# Altium schematic sheet RAM1_top.SchDoc
size 381 x 381 mm; SheetNumber: 1; SheetTotal: 2
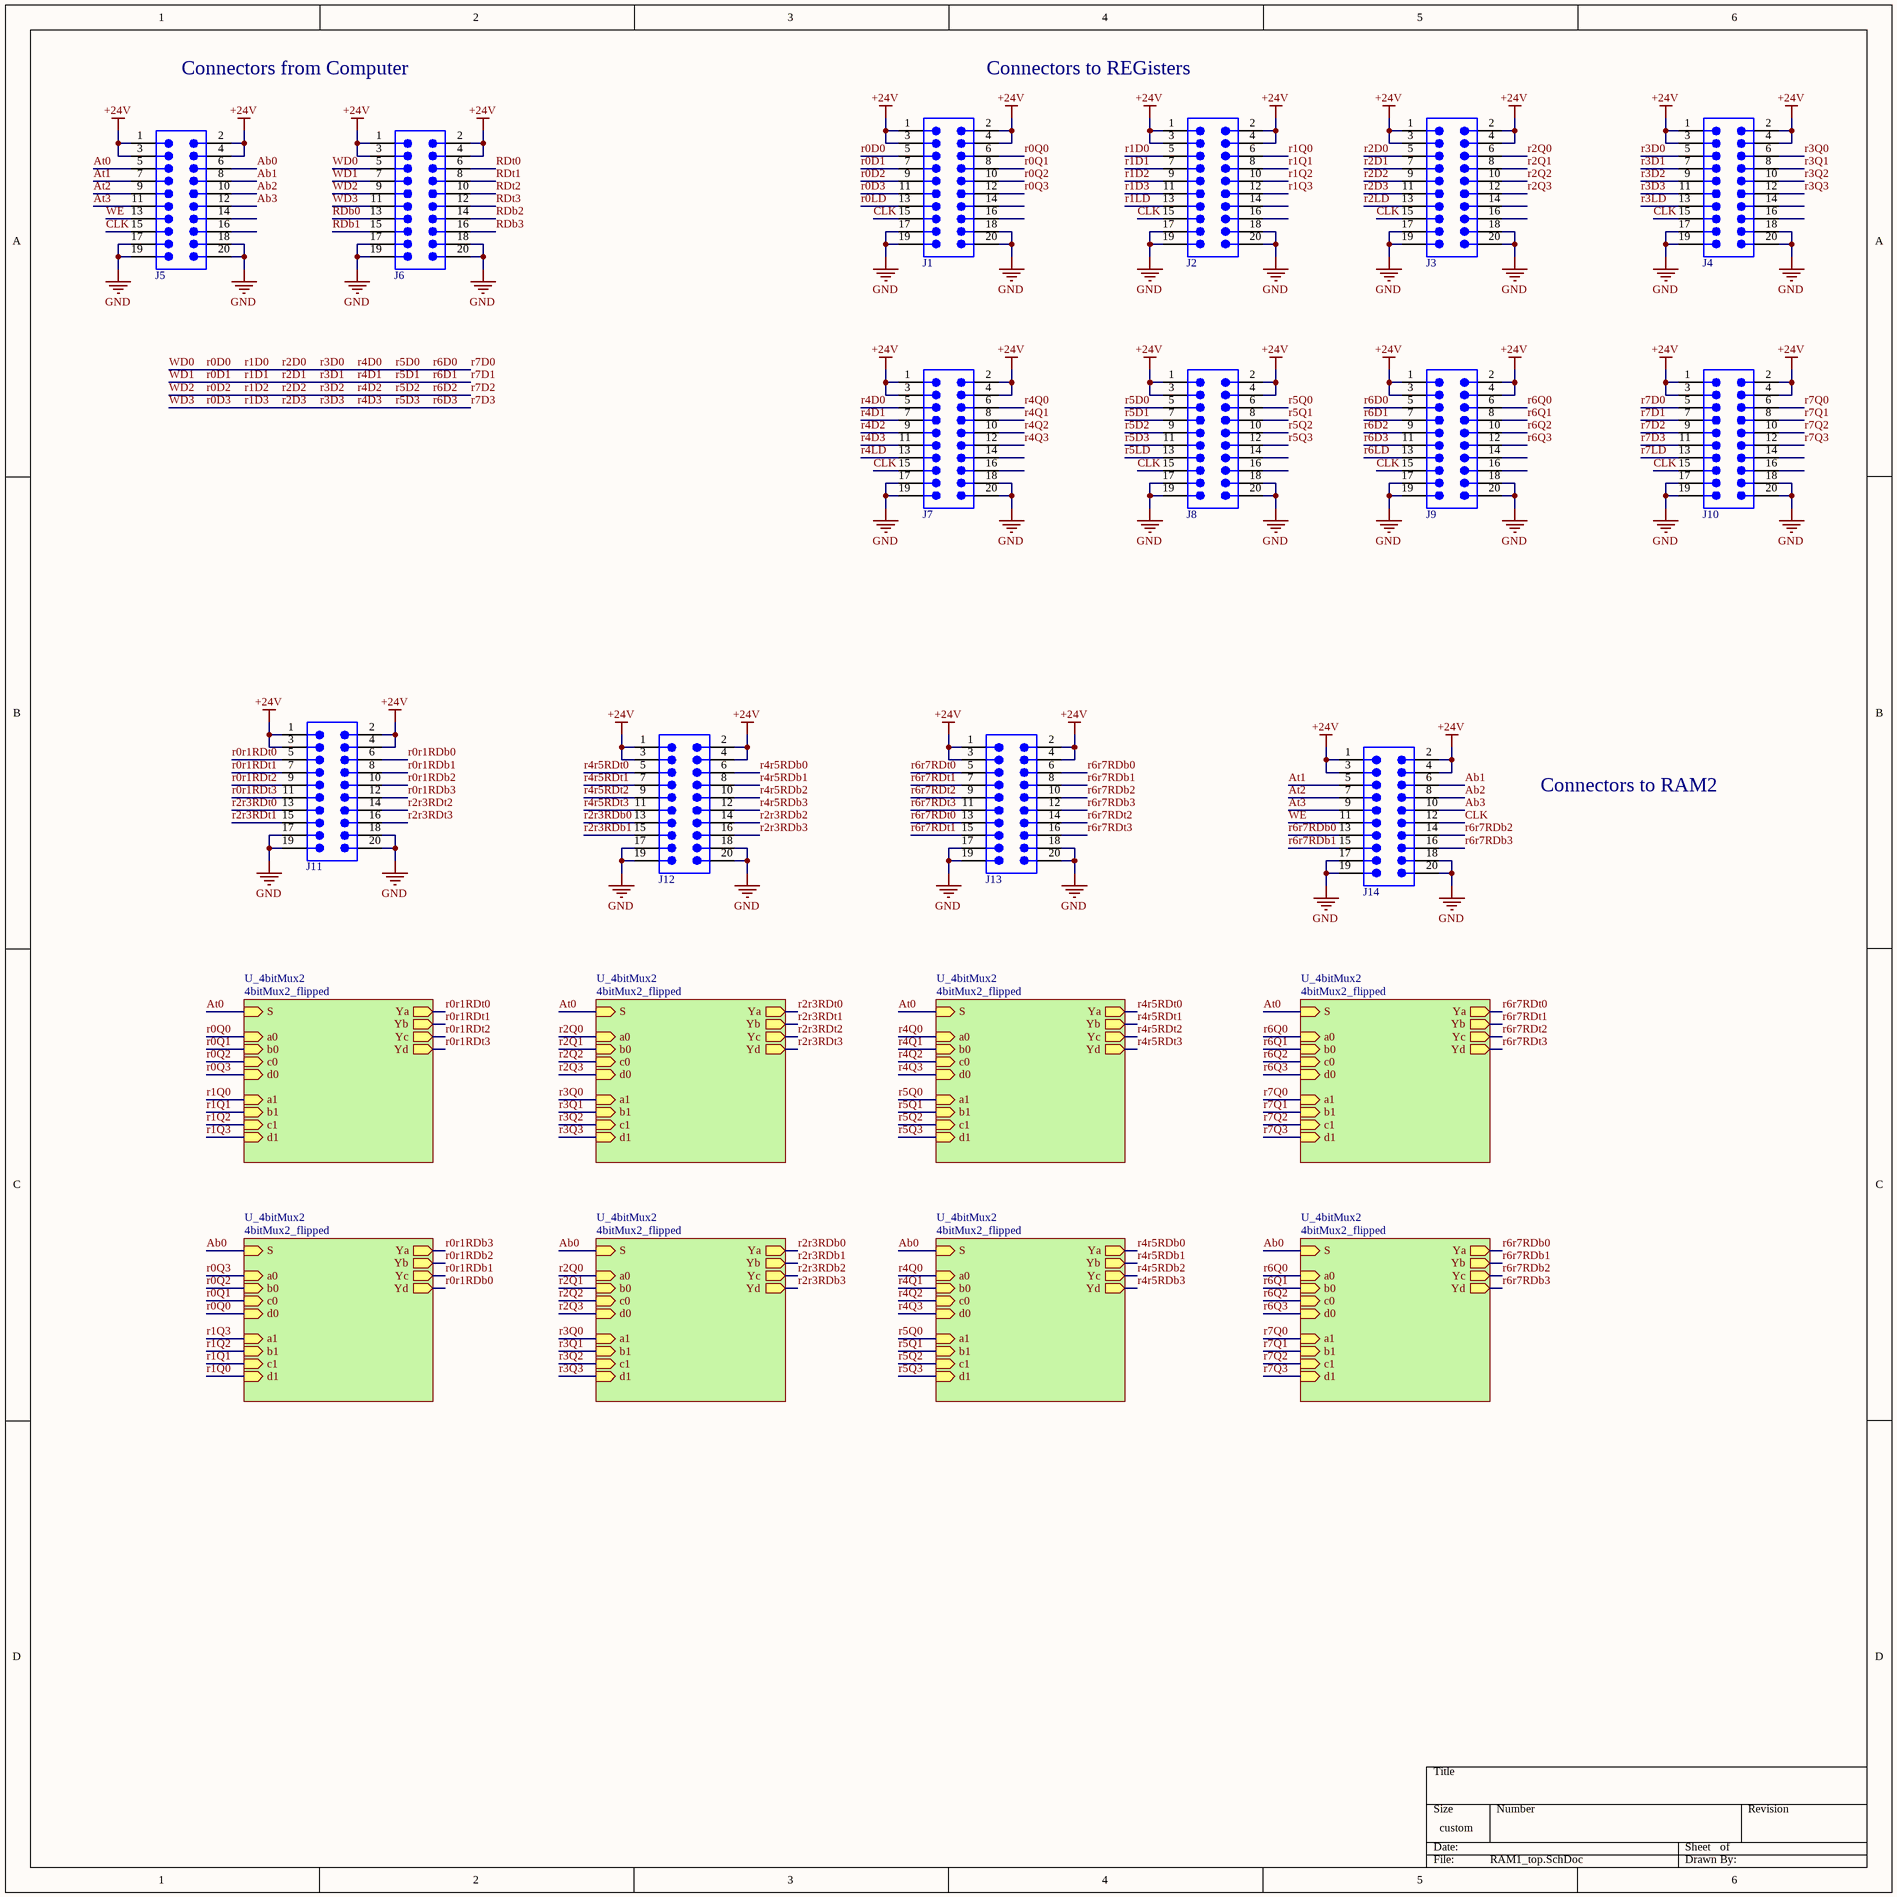
[diagram p0: RAM1_top.SchDoc]

## Parts
J1  Con 2.54mm 10x2pos  [Con 2.54mm 10x2pos]  (value not drawn)
J2  Con 2.54mm 10x2pos  [Con 2.54mm 10x2pos]  (value not drawn)
J3  Con 2.54mm 10x2pos  [Con 2.54mm 10x2pos]  (value not drawn)
J4  Con 2.54mm 10x2pos  [Con 2.54mm 10x2pos]  (value not drawn)
J5  Con 2.54mm 10x2pos  [Con 2.54mm 10x2pos]  (value not drawn)
J6  Con 2.54mm 10x2pos  [Con 2.54mm 10x2pos]  (value not drawn)
J7  Con 2.54mm 10x2pos  [Con 2.54mm 10x2pos]  (value not drawn)
J8  Con 2.54mm 10x2pos  [Con 2.54mm 10x2pos]  (value not drawn)
J9  Con 2.54mm 10x2pos  [Con 2.54mm 10x2pos]  (value not drawn)
J10  Con 2.54mm 10x2pos  [Con 2.54mm 10x2pos]  (value not drawn)
J11  Con 2.54mm 10x2pos  [Con 2.54mm 10x2pos]  (value not drawn)
J12  Con 2.54mm 10x2pos  [Con 2.54mm 10x2pos]  (value not drawn)
J13  Con 2.54mm 10x2pos  [Con 2.54mm 10x2pos]  (value not drawn)
J14  Con 2.54mm 10x2pos  [Con 2.54mm 10x2pos]  (value not drawn)

## Sub-sheets
U_4bitMux2 = 4bitMux2_flipped: S (in), a0 (in), a1 (in), Ya (out), b0 (in), b1 (in), Yb (out), c0 (in), c1 (in), Yc (out), d0 (in), d1 (in), Yd (out)
U_4bitMux2 = 4bitMux2_flipped: S (in), a0 (in), a1 (in), Ya (out), b0 (in), b1 (in), Yb (out), c0 (in), c1 (in), Yc (out), d0 (in), d1 (in), Yd (out)
U_4bitMux2 = 4bitMux2_flipped: S (in), a0 (in), a1 (in), Ya (out), b0 (in), b1 (in), Yb (out), c0 (in), c1 (in), Yc (out), d0 (in), d1 (in), Yd (out)
U_4bitMux2 = 4bitMux2_flipped: S (in), a0 (in), a1 (in), Ya (out), b0 (in), b1 (in), Yb (out), c0 (in), c1 (in), Yc (out), d0 (in), d1 (in), Yd (out)
U_4bitMux2 = 4bitMux2_flipped: S (in), a0 (in), a1 (in), Ya (out), b0 (in), b1 (in), Yb (out), c0 (in), c1 (in), Yc (out), d0 (in), d1 (in), Yd (out)
U_4bitMux2 = 4bitMux2_flipped: S (in), a0 (in), a1 (in), Ya (out), b0 (in), b1 (in), Yb (out), c0 (in), c1 (in), Yc (out), d0 (in), d1 (in), Yd (out)
U_4bitMux2 = 4bitMux2_flipped: S (in), a0 (in), a1 (in), Ya (out), b0 (in), b1 (in), Yb (out), c0 (in), c1 (in), Yc (out), d0 (in), d1 (in), Yd (out)
U_4bitMux2 = 4bitMux2_flipped: S (in), a0 (in), a1 (in), Ya (out), b0 (in), b1 (in), Yb (out), c0 (in), c1 (in), Yc (out), d0 (in), d1 (in), Yd (out)

## Nets
+24V: J1.1 J1.2 J1.3 J1.4 J2.1 J2.2 J2.3 J2.4 J3.1 J3.2 J3.3 J3.4 J4.1 J4.2 J4.3 J4.4 J5.1 J5.2 J5.3 J5.4 J6.1 J6.2 J6.3 J6.4 J7.1 J7.2 J7.3 J7.4 J8.1 J8.2 J8.3 J8.4 J9.1 J9.2 J9.3 J9.4 J10.1 J10.2 J10.3 J10.4 J11.1 J11.2 J11.3 J11.4 J12.1 J12.2 J12.3 J12.4 J13.1 J13.2 J13.3 J13.4 J14.1 J14.2 J14.3 J14.4
GND: J1.17 J1.18 J1.19 J1.20 J2.17 J2.18 J2.19 J2.20 J3.17 J3.18 J3.19 J3.20 J4.17 J4.18 J4.19 J4.20 J5.17 J5.18 J5.19 J5.20 J6.17 J6.18 J6.19 J6.20 J7.17 J7.18 J7.19 J7.20 J8.17 J8.18 J8.19 J8.20 J9.17 J9.18 J9.19 J9.20 J10.17 J10.18 J10.19 J10.20 J11.17 J11.18 J11.19 J11.20 J12.17 J12.18 J12.19 J12.20 J13.17 J13.18 J13.19 J13.20 J14.17 J14.18 J14.19 J14.20
Ab0: J5.6 ; sheet U_4bitMux2/S, sheet U_4bitMux2/S, sheet U_4bitMux2/S, sheet U_4bitMux2/S
Ab1: J5.8 J14.6
Ab2: J5.10 J14.8
Ab3: J5.12 J14.10
At0: J5.5 ; sheet U_4bitMux2/S, sheet U_4bitMux2/S, sheet U_4bitMux2/S, sheet U_4bitMux2/S
At1: J5.7 J14.5
At2: J5.9 J14.7
At3: J5.11 J14.9
CLK: J1.15 J2.15 J3.15 J4.15 J5.15 J7.15 J8.15 J9.15 J10.15 J14.12
r0D0: J1.5 J2.5 J3.5 J4.5 J6.5 J7.5 J8.5 J9.5 J10.5  [also labelled r1D0, r2D0, r3D0, r4D0, r5D0, r6D0, r7D0, WD0]
r0D1: J1.7 J2.7 J3.7 J4.7 J6.7 J7.7 J8.7 J9.7 J10.7  [also labelled r1D1, r2D1, r3D1, r4D1, r5D1, r6D1, r7D1, WD1]
r0D2: J1.9 J2.9 J3.9 J4.9 J6.9 J7.9 J8.9 J9.9 J10.9  [also labelled r1D2, r2D2, r3D2, r4D2, r5D2, r6D2, r7D2, WD2]
r0D3: J1.11 J2.11 J3.11 J4.11 J6.11 J7.11 J8.11 J9.11 J10.11  [also labelled r1D3, r2D3, r3D3, r4D3, r5D3, r6D3, r7D3, WD3]
r0LD: J1.13
r0Q0: J1.6 ; sheet U_4bitMux2/a0, sheet U_4bitMux2/d0
r0Q1: J1.8 ; sheet U_4bitMux2/b0, sheet U_4bitMux2/c0
r0Q2: J1.10 ; sheet U_4bitMux2/c0, sheet U_4bitMux2/b0
r0Q3: J1.12 ; sheet U_4bitMux2/d0, sheet U_4bitMux2/a0
r0r1RDb0: J11.6 ; sheet U_4bitMux2/Yd
r0r1RDb1: J11.8 ; sheet U_4bitMux2/Yc
r0r1RDb2: J11.10 ; sheet U_4bitMux2/Yb
r0r1RDb3: J11.12 ; sheet U_4bitMux2/Ya
r0r1RDt0: J11.5 ; sheet U_4bitMux2/Ya
r0r1RDt1: J11.7 ; sheet U_4bitMux2/Yb
r0r1RDt2: J11.9 ; sheet U_4bitMux2/Yc
r0r1RDt3: J11.11 ; sheet U_4bitMux2/Yd
r1LD: J2.13
r1Q0: J2.6 ; sheet U_4bitMux2/a1, sheet U_4bitMux2/d1
r1Q1: J2.8 ; sheet U_4bitMux2/b1, sheet U_4bitMux2/c1
r1Q2: J2.10 ; sheet U_4bitMux2/c1, sheet U_4bitMux2/b1
r1Q3: J2.12 ; sheet U_4bitMux2/d1, sheet U_4bitMux2/a1
r2LD: J3.13
r2Q0: J3.6 ; sheet U_4bitMux2/a0, sheet U_4bitMux2/a0
r2Q1: J3.8 ; sheet U_4bitMux2/b0, sheet U_4bitMux2/b0
r2Q2: J3.10 ; sheet U_4bitMux2/c0, sheet U_4bitMux2/c0
r2Q3: J3.12 ; sheet U_4bitMux2/d0, sheet U_4bitMux2/d0
r2r3RDb0: J12.13 ; sheet U_4bitMux2/Ya
r2r3RDb1: J12.15 ; sheet U_4bitMux2/Yb
r2r3RDb2: J12.14 ; sheet U_4bitMux2/Yc
r2r3RDb3: J12.16 ; sheet U_4bitMux2/Yd
r2r3RDt0: J11.13 ; sheet U_4bitMux2/Ya
r2r3RDt1: J11.15 ; sheet U_4bitMux2/Yb
r2r3RDt2: J11.14 ; sheet U_4bitMux2/Yc
r2r3RDt3: J11.16 ; sheet U_4bitMux2/Yd
r3LD: J4.13
r3Q0: J4.6 ; sheet U_4bitMux2/a1, sheet U_4bitMux2/a1
r3Q1: J4.8 ; sheet U_4bitMux2/b1, sheet U_4bitMux2/b1
r3Q2: J4.10 ; sheet U_4bitMux2/c1, sheet U_4bitMux2/c1
r3Q3: J4.12 ; sheet U_4bitMux2/d1, sheet U_4bitMux2/d1
r4LD: J7.13
r4Q0: J7.6 ; sheet U_4bitMux2/a0, sheet U_4bitMux2/a0
r4Q1: J7.8 ; sheet U_4bitMux2/b0, sheet U_4bitMux2/b0
r4Q2: J7.10 ; sheet U_4bitMux2/c0, sheet U_4bitMux2/c0
r4Q3: J7.12 ; sheet U_4bitMux2/d0, sheet U_4bitMux2/d0
r4r5RDb0: J12.6 ; sheet U_4bitMux2/Ya
r4r5RDb1: J12.8 ; sheet U_4bitMux2/Yb
r4r5RDb2: J12.10 ; sheet U_4bitMux2/Yc
r4r5RDb3: J12.12 ; sheet U_4bitMux2/Yd
r4r5RDt0: J12.5 ; sheet U_4bitMux2/Ya
r4r5RDt1: J12.7 ; sheet U_4bitMux2/Yb
r4r5RDt2: J12.9 ; sheet U_4bitMux2/Yc
r4r5RDt3: J12.11 ; sheet U_4bitMux2/Yd
r5LD: J8.13
r5Q0: J8.6 ; sheet U_4bitMux2/a1, sheet U_4bitMux2/a1
r5Q1: J8.8 ; sheet U_4bitMux2/b1, sheet U_4bitMux2/b1
r5Q2: J8.10 ; sheet U_4bitMux2/c1, sheet U_4bitMux2/c1
r5Q3: J8.12 ; sheet U_4bitMux2/d1, sheet U_4bitMux2/d1
r6LD: J9.13
r6Q0: J9.6 ; sheet U_4bitMux2/a0, sheet U_4bitMux2/a0
r6Q1: J9.8 ; sheet U_4bitMux2/b0, sheet U_4bitMux2/b0
r6Q2: J9.10 ; sheet U_4bitMux2/c0, sheet U_4bitMux2/c0
r6Q3: J9.12 ; sheet U_4bitMux2/d0, sheet U_4bitMux2/d0
r6r7RDb0: J13.6 J14.13 ; sheet U_4bitMux2/Ya
r6r7RDb1: J13.8 J14.15 ; sheet U_4bitMux2/Yb
r6r7RDb2: J13.10 J14.14 ; sheet U_4bitMux2/Yc
r6r7RDb3: J13.12 J14.16 ; sheet U_4bitMux2/Yd
r6r7RDt0: J13.5 J13.13 ; sheet U_4bitMux2/Ya
r6r7RDt1: J13.7 J13.15 ; sheet U_4bitMux2/Yb
r6r7RDt2: J13.9 J13.14 ; sheet U_4bitMux2/Yc
r6r7RDt3: J13.11 J13.16 ; sheet U_4bitMux2/Yd
r7LD: J10.13
r7Q0: J10.6 ; sheet U_4bitMux2/a1, sheet U_4bitMux2/a1
r7Q1: J10.8 ; sheet U_4bitMux2/b1, sheet U_4bitMux2/b1
r7Q2: J10.10 ; sheet U_4bitMux2/c1, sheet U_4bitMux2/c1
r7Q3: J10.12 ; sheet U_4bitMux2/d1, sheet U_4bitMux2/d1
RDb0: J6.13
RDb1: J6.15
RDb2: J6.14
RDb3: J6.16
RDt0: J6.6
RDt1: J6.8
RDt2: J6.10
RDt3: J6.12
WE: J5.13 J14.11

Not connected (* = marked no-connect by the designer): J1 14 16; J2 14 16; J3 14 16; J4 14 16; J5 14 16; J7 14 16; J8 14 16; J9 14 16; J10 14 16

## Notes on the sheet
- Connectors from Computer
- Connectors to REGisters
- Connectors to RAM2

## Library data of the parts
J1-J14 = Con 2.54mm 10x2pos: WR-BHD Straight Male, Box Header, Through Hole, 2 Rows, 20 Contacts, 2.54mm Pitch; Manufacturer: Wurth Elektronik; Manufacturer Part Number: 61202021621; Connector Type: Male Pin; Contact Resistance: 20mΩ; Current Rating: 3A; Insulation: Insulated; Insulation Resistance: 1GΩ; Number of Contacts: 20; Operating Supply Voltage: 250V; Supplier: DigiKey; Supplier Part Number: 732-2096-ND; RoHS: Compliant; Category: Headers and Wire Housings; Stock: 12933; Pricing: 1=0.86, 10=0.839, 50=0.7732, 160=0.69213, 320=0.64375 (USD); Color: Black; Contact Gender: Male; Contact Material: Gold; Contact Plating: Gold; Flammability Rating: UL94 V-0; Gender: Male; Height: 9.25mm; Housing Material: PBT; Insulation Material: PBT; Lead Pitch: 2.54mm; Length: 33.06mm; Max Operating Temperature: 105°C; Min Operating Temperature: -40°C; Mounting Technology: Through Hole; Pins: 20; Number of Positions: 20; Number of Rows: 2; Orientation: Vertical; Pitch: 2.54mm; Row Spacing: 2.54mm; Termination: Through Hole; Voltage Rating: 250V; Voltage Rating (DC): 250V; Width: 33.06mm; ComponentLink1URL: https://datasheet.octopart.com:443/61202021621-W%C3%BCrth-Elektronik-datasheet-111087935.pdf?src-supplier=Upverter; ComponentLink1Description: https://datasheet.octopart.com:443/61202021621-W%C3%BCrth-Elektronik-datasheet-111087935.pdf?src-supplier=Upverter; ComponentLink2URL: https://datasheet.octopart.com:443/61202021621-Wurth-Elektronik-datasheet-168480024.pdf?src-supplier=Wurth+Elektronik; ComponentLink2Description: https://datasheet.octopart.com:443/61202021621-Wurth-Elektronik-datasheet-168480024.pdf?src-supplier=Wurth+Elektronik; ComponentLink3URL: https://datasheet.octopart.com:443/61202021621-W%C3%BCrth-Elektronik-datasheet-149523954.pdf?src-supplier=Farnell; ComponentLink3Description: https://datasheet.octopart.com:443/61202021621-W%C3%BCrth-Elektronik-datasheet-149523954.pdf?src-supplier=Farnell; ComponentLink4URL: https://datasheet.octopart.com:443/61202021621-W%C3%BCrth-Elektronik-Midcom-datasheet-10469446.pdf?src-supplier=Farnell; ComponentLink4Description: https://datasheet.octopart.com:443/61202021621-W%C3%BCrth-Elektronik-Midcom-datasheet-10469446.pdf?src-supplier=Farnell; ComponentLink5URL: https://datasheet.octopart.com:443/61202021621-W%C3%BCrth-Elektronik-Midcom-datasheet-5367532.pdf?src-supplier=element14+APAC; ComponentLink5Description: https://datasheet.octopart.com:443/61202021621-W%C3%BCrth-Elektronik-Midcom-datasheet-5367532.pdf?src-supplier=element14+APAC